# EasyEDA Pro project bandolibre.eprj, schematic WingConnector
Board Name: WingConnector; Create Date: 2026-05-26; Page Name: P1; Project Name: bandoneo; Schematic Name: WingConnector; Update Date: 2026-05-26; Company: EasyEDA.com; Page Size: A4; Version: V1.0
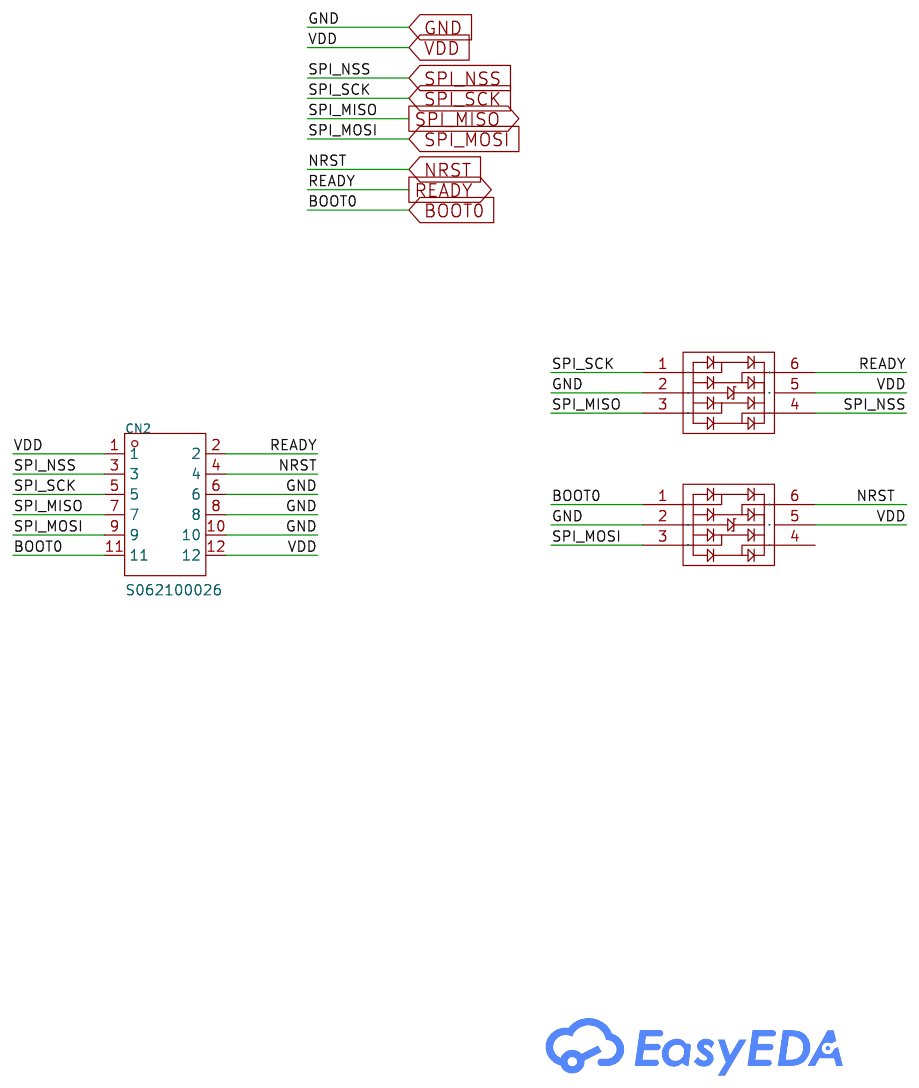
[diagram p8: schematic sheet]

## Parts
CN2  S062100026  [CONN-SMD_S062100026]
TV1  SRV05-4-P-T7  [SOT-23-6_L2.9-W1.6-P0.95-LS2.8-BR]
TV2  SRV05-4-P-T7  [SOT-23-6_L2.9-W1.6-P0.95-LS2.8-BR]

## Library data of the parts
CN2 = S062100026: Pins Structure:2x6P Pitch:1.27mm Mounting Type:Surface Mount,Vertical Reference Series:- Number of Pins:12P Number of Rows:2 Number of PINs Per Row:6 Row Spacing:1.27mm Current Rating:1A Contact Material:Brass Contact Plating:Tin Operating Temperature:-40; LCSC Part Name: 2x6P 间距:1.27mm 立贴; Supplier Part: C908152; Manufacturer: Ckmtw(灿科盟); Supplier Footprint: SMD,P=1.27mm; JLCPCB Part Class: Extended Part; Datasheet: https://item.szlcsc.com/datasheet/S062100026/974103.html; Supplier: LCSC; Pins Structure: 2x6P; Pitch: 1.27mm; Mounting Type: Surface Mount,Vertical; Number of Pins: 12P; Number of Rows: 2; Number of PINs Per Row: 6; Row Spacing: 1.27mm; Current Rating: 1A; Contact Material: Brass; Contact Plating: Tin; Operating Temperature: -40℃~+105℃; Plastic Material: PA6T; Flame Retardant Rating: UL94V-0; X-Length of Bottom Edge on Board (Spacing Line): 7.5mm
TV1 TV2 = SRV05-4-P-T7_C85364: Reverse Stand-Off Voltage (Vrwm):5V Clamping Voltage:12V Peak Pulse Current (Ipp):1A@8/20us Voltage - Breakdown:6V Type:TVS; Supplier Part: C85364; Manufacturer: PROTEK; Supplier Footprint: SOT-23-6; JLCPCB Part Class: Extended Part; Datasheet: https://atta.szlcsc.com/upload/public/pdf/source/20161024/1477288764689.pdf; Supplier: LCSC; Reverse Stand-Off Voltage (Vrwm): 5V; Clamping Voltage: 12V; Peak Pulse Current (Ipp): 1A@8/20us; Voltage - Breakdown: 6V; Type: TVS

## Nets
GND: CN2.6 CN2.8 CN2.10 TV1.2 TV2.2
VDD: CN2.1 CN2.12 TV1.5 TV2.5
BOOT0: CN2.11 TV2.1
NRST: CN2.4 TV2.6
READY: CN2.2 TV1.6
SPI_MISO: CN2.7 TV1.3
SPI_MOSI: CN2.9 TV2.3
SPI_NSS: CN2.3 TV1.4
SPI_SCK: CN2.5 TV1.1

Not connected (* = marked no-connect by the designer): TV2 4
